# Altium schematic sheet 电源舱控制板.SchDoc
size A3
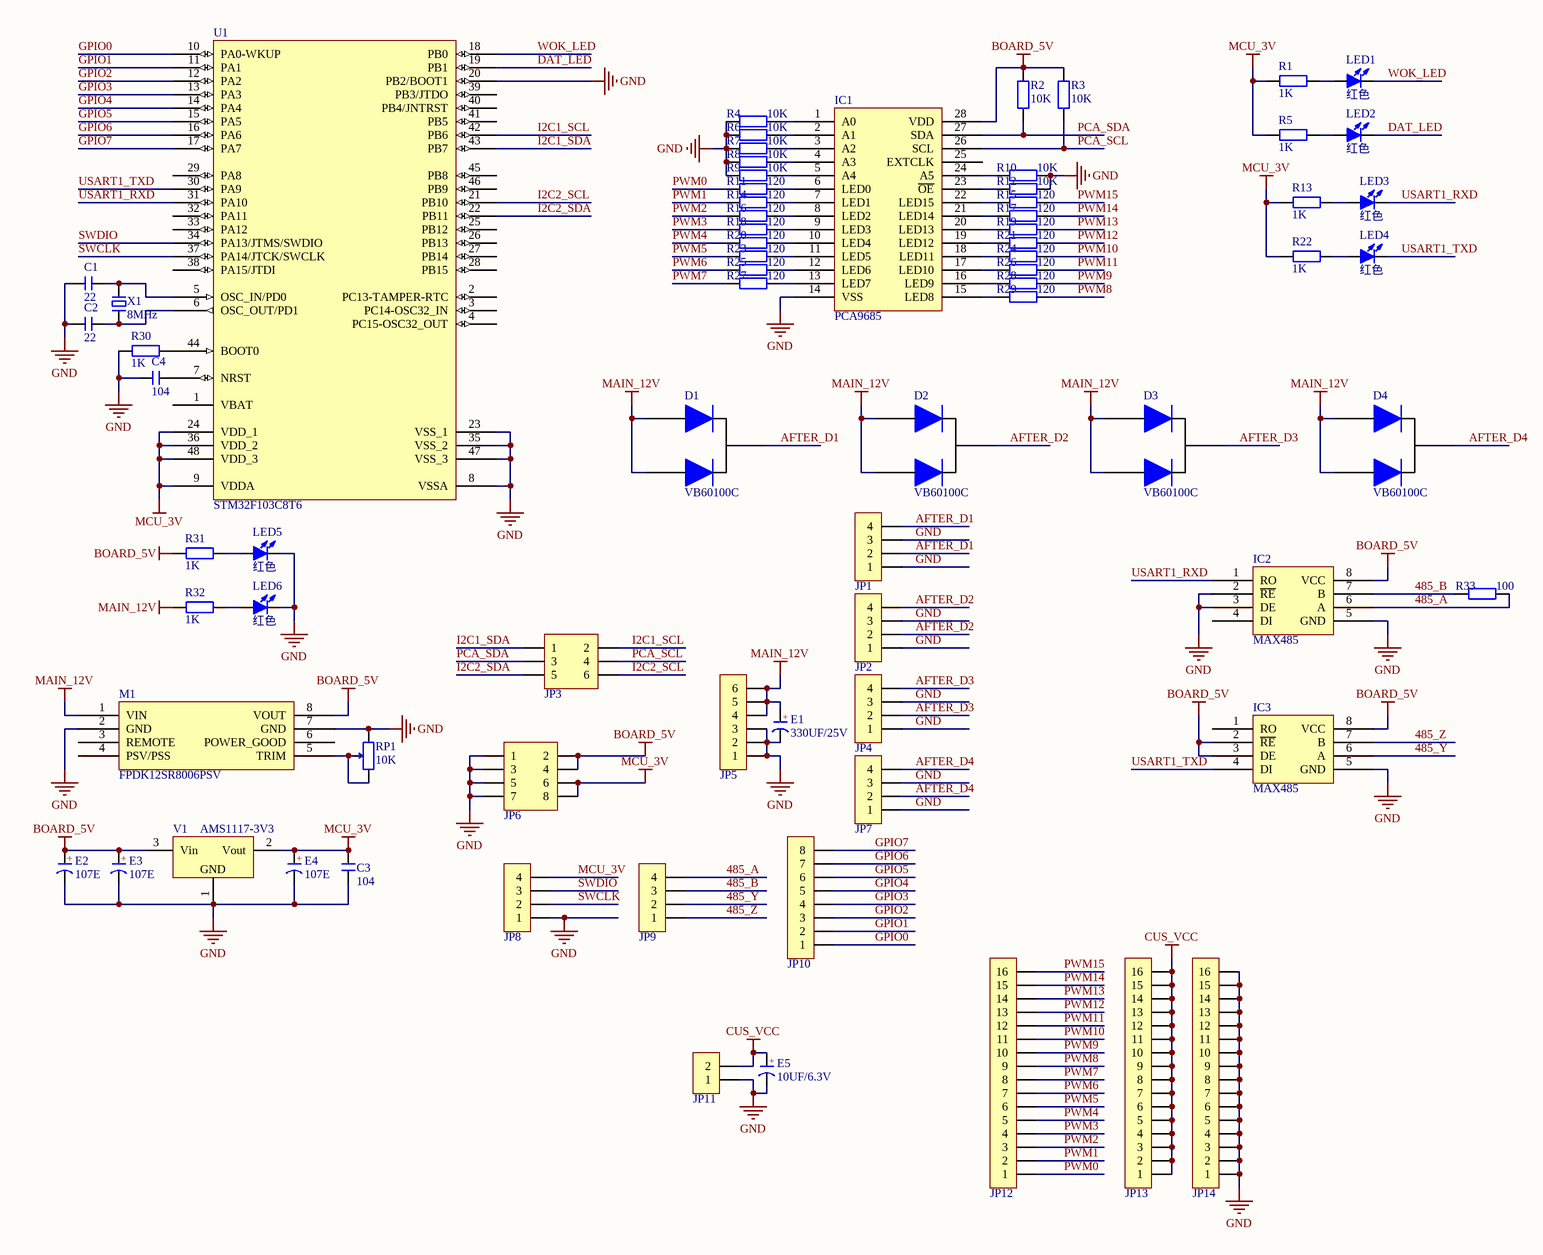
[diagram p0: 电源舱控制板.SchDoc]

## Parts
C1  22  [C 0201]
C2  22  [C 0201]
C3  104  [C 0201]
C4  104  [C 0201]
D1  VB60100C  [TO263-3B]
D2  VB60100C  [TO263-3B]
D3  VB60100C  [TO263-3B]
D4  VB60100C  [TO263-3B]
E1  330UF/25V  [CS 2.0*5*8 - C]
E2  107E  [CD A(3216)]
E3  107E  [CD A(3216)]
E4  107E  [CD A(3216)]
E5  10UF/6.3V  [CS 2.0*5*8 - C]
IC1  PCA9685  [TSSOP28_M]
IC2  MAX485  [SOP8W_M]
IC3  MAX485  [SOP8W_M]
JP1  HDR-1X4  [HDR-1X4]  (value not drawn)
JP2  HDR-1X4  [HDR-1X4]  (value not drawn)
JP3  Header3X2  [HDR-3X2]  (value not drawn)
JP4  HDR-1X4  [HDR-1X4]  (value not drawn)
JP5  HDR-1X6  [HDR-1X6]  (value not drawn)
JP6  Header 4X2  [HDR-4X2]  (value not drawn)
JP7  HDR-1X4  [HDR-1X4]  (value not drawn)
JP8  HDR-1X4  [HDR-1X4]  (value not drawn)
JP9  HDR-1X4  [HDR-1X4]  (value not drawn)
JP10  HDR-1X8  [HDR-1X8]  (value not drawn)
JP11  HDR-1X2  [KF128-5.08-2P]  (value not drawn)
JP12  HDR-1X16  [HDR-1X16]  (value not drawn)
JP13  HDR-1X16  [HDR-1X16]  (value not drawn)
JP14  HDR-1X16  [HDR-1X16]  (value not drawn)
LED1  红色  [LED 0603W]
LED2  红色  [LED 0603W]
LED3  红色  [LED 0603W]
LED4  红色  [LED 0603W]
LED5  红色  [LED 0603W]
LED6  红色  [LED 0603W]
M1  FPDK12SR8006PSV  [FPDK12SR8006PSV]
R1  1K  [R 0201]
R2  10K  [R 0201]
R3  10K  [R 0201]
R4  10K  [R 0201]
R5  1K  [R 0201]
R6  10K  [R 0201]
R7  10K  [R 0201]
R8  10K  [R 0201]
R9  10K  [R 0201]
R10  10K  [R 0201]
R11  120  [R 0201]
R12  10K  [R 0201]
R13  1K  [R 0201]
R14  120  [R 0201]
R15  120  [R 0201]
R16  120  [R 0201]
R17  120  [R 0201]
R18  120  [R 0201]
R19  120  [R 0201]
R20  120  [R 0201]
R21  120  [R 0201]
R22  1K  [R 0201]
R23  120  [R 0201]
R24  120  [R 0201]
R25  120  [R 0201]
R26  120  [R 0201]
R27  120  [R 0201]
R28  120  [R 0201]
R29  120  [R 0201]
R30  1K  [R 0201]
R31  1K  [R 0201]
R32  1K  [R 0201]
R33  100  [R 0201]
RP1  10K  [3296W]
U1  STM32F103C8T6  [LQFP48 7X7_N]
V1  AMS1117-3V3  [SOT223_L]
X1  8MHz  [XTAL-49S DIP]

## Nets
BOARD_5V: E2.1(A) E3.1(A) IC1.28(VDD) IC2.8(VCC) IC3.2(~{RE}) IC3.3(DE) IC3.8(VCC) JP6.2 JP6.4 M1.8(VOUT) R2.2 R3.2 R31.1 V1.3(Vin)
CUS_VCC: E5.1(A) JP11.2 JP13.1 JP13.2 JP13.3 JP13.4 JP13.5 JP13.6 JP13.7 JP13.8 JP13.9 JP13.10 JP13.11 JP13.12 JP13.13 JP13.14 JP13.15 JP13.16
GND: C1.1 C2.1 C3.1 C4.1 E1.2(K) E2.2(K) E3.2(K) E4.2(K) E5.2(K) IC1.14(VSS) IC2.2(~{RE}) IC2.3(DE) IC2.5(GND) IC3.5(GND) JP1.1 JP1.3 JP2.1 JP2.3 JP4.1 JP4.3 JP5.1 JP5.2 JP5.3 JP6.1 JP6.3 JP6.5 JP6.7 JP7.1 JP7.3 JP8.1 JP11.1 JP14.1 JP14.2 JP14.3 JP14.4 JP14.5 JP14.6 JP14.7 JP14.8 JP14.9 JP14.10 JP14.11 JP14.12 JP14.13 JP14.14 JP14.15 JP14.16 LED5.2(K) LED6.2(K) M1.2(GND) M1.7(GND) R4.1 R6.1 R7.1 R8.1 R9.1 R10.2 R12.2 R30.2 RP1.3 U1.8(VSSA) U1.20(PB2/BOOT1) U1.23(VSS_1) U1.35(VSS_2) U1.47(VSS_3) V1.1(GND)
MAIN_12V: D1.1 D1.3 D2.1 D2.3 D3.1 D3.3 D4.1 D4.3 E1.1(A) JP5.4 JP5.5 JP5.6 M1.1(VIN) R32.1
MCU_3V: C3.2 E4.1(A) JP6.6 JP6.8 JP8.4 R1.1 R5.1 R13.1 R22.1 U1.9(VDDA) U1.24(VDD_1) U1.36(VDD_2) U1.48(VDD_3) V1.2(Vout)
485_A: IC2.6(A) JP9.4 R33.2
485_B: IC2.7(B) JP9.3 R33.1
485_Y: IC3.6(A) JP9.2
485_Z: IC3.7(B) JP9.1
AFTER_D1: D1.2 JP1.2 JP1.4
AFTER_D2: D2.2 JP2.2 JP2.4
AFTER_D3: D3.2 JP4.2 JP4.4
AFTER_D4: D4.2 JP7.2 JP7.4
DAT_LED: LED2.2(K) U1.19(PB1)
GPIO0: JP10.1 U1.10(PA0-WKUP)
GPIO1: JP10.2 U1.11(PA1)
GPIO2: JP10.3 U1.12(PA2)
GPIO3: JP10.4 U1.13(PA3)
GPIO4: JP10.5 U1.14(PA4)
GPIO5: JP10.6 U1.15(PA5)
GPIO6: JP10.7 U1.16(PA6)
GPIO7: JP10.8 U1.17(PA7)
I2C1_SCL: JP3.2 U1.42(PB6)
I2C1_SDA: JP3.1 U1.43(PB7)
I2C2_SCL: JP3.6 U1.21(PB10)
I2C2_SDA: JP3.5 U1.22(PB11)
PCA_SCL: IC1.26(SCL) JP3.4 R3.1
PCA_SDA: IC1.27(SDA) JP3.3 R2.1
PWM0: JP12.1 R11.1
PWM1: JP12.2 R14.1
PWM2: JP12.3 R16.1
PWM3: JP12.4 R18.1
PWM4: JP12.5 R20.1
PWM5: JP12.6 R23.1
PWM6: JP12.7 R25.1
PWM7: JP12.8 R27.1
PWM8: JP12.9 R29.2
PWM9: JP12.10 R28.2
PWM10: JP12.11 R24.2
PWM11: JP12.12 R26.2
PWM12: JP12.13 R21.2
PWM13: JP12.14 R19.2
PWM14: JP12.15 R17.2
PWM15: JP12.16 R15.2
SWCLK: JP8.2 U1.37(PA14/JTCK/SWCLK)
SWDIO: JP8.3 U1.34(PA13/JTMS/SWDIO)
USART1_RXD: IC2.1(RO) LED3.2(K) U1.31(PA10)
USART1_TXD: IC3.4(DI) LED4.2(K) U1.30(PA9)
WOK_LED: LED1.2(K) U1.18(PB0)
NetC1_2: C1.2 U1.5(OSC_IN/PD0) X1.2
NetC2_2: C2.2 U1.6(OSC_OUT/PD1) X1.1
NetC4_2: C4.2 U1.7(NRST)
NetIC1_1: IC1.1(A0) R4.2
NetIC1_2: IC1.2(A1) R6.2
NetIC1_3: IC1.3(A2) R7.2
NetIC1_4: IC1.4(A3) R8.2
NetIC1_5: IC1.5(A4) R9.2
NetIC1_6: IC1.6(LED0) R11.2
NetIC1_7: IC1.7(LED1) R14.2
NetIC1_8: IC1.8(LED2) R16.2
NetIC1_9: IC1.9(LED3) R18.2
NetIC1_10: IC1.10(LED4) R20.2
NetIC1_11: IC1.11(LED5) R23.2
NetIC1_12: IC1.12(LED6) R25.2
NetIC1_13: IC1.13(LED7) R27.2
NetIC1_15: IC1.15(LED8) R29.1
NetIC1_16: IC1.16(LED9) R28.1
NetIC1_17: IC1.17(LED10) R26.1
NetIC1_18: IC1.18(LED11) R24.1
NetIC1_19: IC1.19(LED12) R21.1
NetIC1_20: IC1.20(LED13) R19.1
NetIC1_21: IC1.21(LED14) R17.1
NetIC1_22: IC1.22(LED15) R15.1
NetIC1_23: IC1.23(~{OE}) R12.1
NetIC1_24: IC1.24(A5) R10.1
NetLED1_1: LED1.1(A) R1.2
NetLED2_1: LED2.1(A) R5.2
NetLED3_1: LED3.1(A) R13.2
NetLED4_1: LED4.1(A) R22.2
NetLED5_1: LED5.1(A) R31.2
NetLED6_1: LED6.1(A) R32.2
NetM1_5: M1.5(TRIM) RP1.1 RP1.2
NetR30_1: R30.1 U1.44(BOOT0)

Not connected (* = marked no-connect by the designer): IC1 25(EXTCLK); IC2 4(DI); IC3 1(RO); M1 3(REMOTE) 4(PSV/PSS) 6(POWER_GOOD); U1 1(VBAT) 2(PC13-TAMPER-RTC) 3(PC14-OSC32_IN) 4(PC15-OSC32_OUT) 25(PB12) 26(PB13) 27(PB14) 28(PB15) 29(PA8) 32(PA11) 33(PA12) 38(PA15/JTDI) 39(PB3/JTDO) 40(PB4/JNTRST) 41(PB5) 45(PB8) 46(PB9)

## Notes on the sheet
- (in symbol C-CD) +
- (in symbol C-CS) +

## Library data of the parts
C1-C4 = C: 无极性贴片电容; 版权归属: 源创客; BOM名称: 无极性贴片电容; 学习资源: www.ooocke.com
D1-D4 = V: 60A 100V 肖特基势垒二极管
E1 E5 = C-CS: 直插固态电容; 版权归属: 源创客; BOM名称: 直插固态电容; 学习资源: www.ooocke.com
E2-E4 = C-CD: 贴片钽电容; 版权归属: 源创客; BOM名称: 贴片钽电容; 学习资源: www.ooocke.com
IC2 IC3 = MAX: 485通信芯片
JP1 JP2 JP4 JP7-JP9 = Hea: 4P接插件; 版权归属: 源创客; BOM名称: 4P接插件; 学习资源: www.ooocke.com
JP3 = Heade: 3*2P接插件; 版权归属: 源创客; BOM名称: 3*2P接插件; 学习资源: www.ooocke.com
JP5 = Hea: 6P接插件; 版权归属: 源创客; BOM名称: 6P接插件; 学习资源: www.ooocke.com
JP6 = Heade: 4*2P接插件; 版权归属: 源创客; BOM名称: 4*2P接插件; 学习资源: www.ooocke.com
JP10 = Hea: 8P接插件; 版权归属: 源创客; BOM名称: 8P接插件; 学习资源: www.ooocke.com
JP11 = Hea: 2P接插件; 版权归属: 源创客; BOM名称: 2P接插件; 学习资源: www.ooocke.com
JP12-JP14 = Head: 16P接插件; 版权归属: 源创客; BOM名称: 16P接插件; 学习资源: www.ooocke.com
LED1-LED6 = LED-SM: 贴片LED; 版权归属: 源创客; BOM名称: 贴片LED; 学习资源: www.ooocke.com
M1 = FPDK12SR8006PSV: DC-DC POWER CONVERTOR 12V-TO-5V
R1-R33 = R: 贴片电阻; 版权归属: 源创客; BOM名称: 贴片电阻; 学习资源: www.ooocke.com
RP1 = RP-ID: 插件单联电位器; BOM名称: 插件电位器; 版权归属: 源创客; 学习资源: www.ooocke.com
U1 = STM32F103: Flaah:64/RAM:20/IO:36; BOM名称: 32位STM单片机; 版权归属: 源创客; 学习资源: www.ooocke.com
V1 = AMS1117: 三端稳压芯片; BOM名称: 稳压芯片; 版权归属: 源创客; 学习资源: www.ooocke.com
X1 = XTAL-2: 2脚晶振; 版权归属: 源创客; BOM名称: 2脚晶振; 学习资源: www.ooocke.com